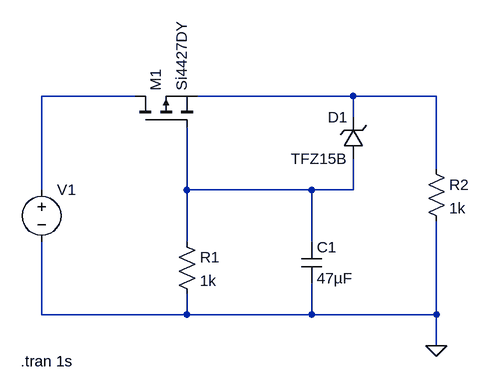
[diagram p0: schematic Reverse_polarity_protection.asc]
Reverse_polarity_protection.asc, the LTspice schematic file:
Version 4
SHEET 1 880 680
WIRE 64 96 -80 96
WIRE 400 96 160 96
WIRE 528 96 400 96
WIRE 400 128 400 96
WIRE 528 208 528 96
WIRE -80 240 -80 96
WIRE 144 240 144 144
WIRE 336 240 144 240
WIRE 400 240 400 192
WIRE 400 240 336 240
WIRE 144 320 144 240
WIRE 336 320 336 240
WIRE -80 432 -80 320
WIRE 144 432 144 400
WIRE 144 432 -80 432
WIRE 336 432 336 384
WIRE 336 432 144 432
WIRE 528 432 528 288
WIRE 528 432 336 432
WIRE 528 480 528 432
FLAG 528 480 0
SYMBOL pmos 64 144 R270
SYMATTR InstName M1
SYMATTR Value Si4427DY
SYMBOL zener 416 192 R180
WINDOW 0 24 64 Left 2
WINDOW 3 24 0 Left 2
SYMATTR InstName D1
SYMATTR Value TFZ15B
SYMATTR Description Diode
SYMATTR Type diode
SYMBOL voltage -80 224 R0
WINDOW 3 24 96 Invisible 2
WINDOW 123 0 0 Left 0
WINDOW 39 0 0 Left 0
SYMATTR Value PULSE(12 -12 100m 1n 1n 100m 200m)
SYMATTR InstName V1
SYMBOL res 512 192 R0
SYMATTR InstName R2
SYMATTR Value 1k
SYMBOL cap 320 320 R0
SYMATTR InstName C1
SYMATTR Value 47µF
SYMBOL res 128 304 R0
SYMATTR InstName R1
SYMATTR Value 1k
TEXT -112 504 Left 2 !.tran 1s

The netlist it stands for:
* Reverse_polarity_protection.asc
M1 N001 N003 N002 N002 Si4427DY
D1 N003 N002 TFZ15B
V1 N001 0 PULSE(12 -12 100m 1n 1n 100m 200m)
R2 N002 0 1k
C1 N003 0 47µF
R1 N003 0 1k
.model D D
.lib standard.dio
.model NMOS NMOS
.model PMOS PMOS
.lib standard.mos
.tran 1s
.backanno
.end